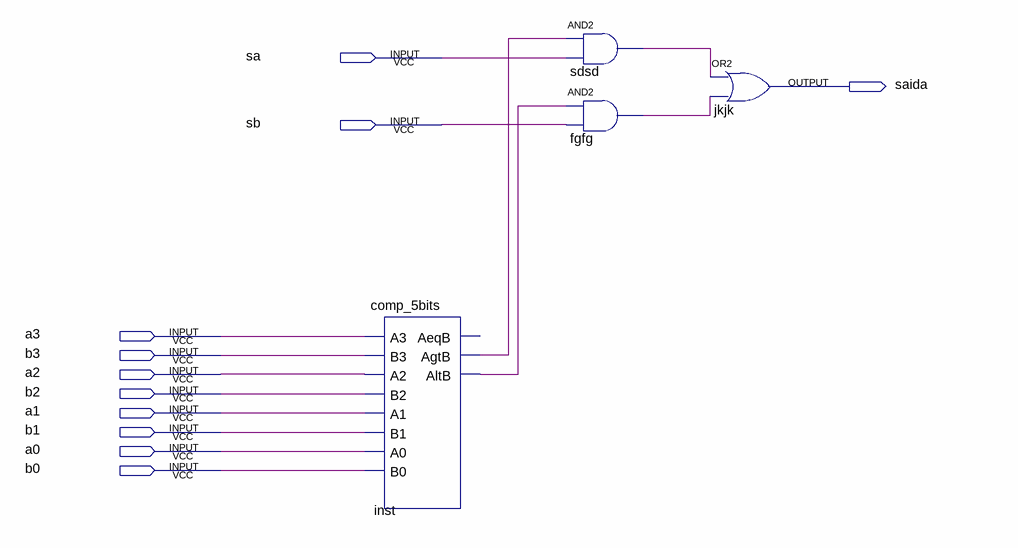
[diagram p0: schematic sheet]
// Quartus schematic LogicaSinal.bdf as structural Verilog: 4 symbols, 11 pins
module LogicaSinal (
  input  sa,
  input  sb,
  input  a3,
  input  b3,
  input  a2,
  input  b2,
  input  a1,
  input  b1,
  input  a0,
  input  b0,
  output saida
);

  wire fgfg_out, inst_agtb, inst_altb, sdsd_out;

  comp_5bits inst (
    .A3(a3), .B3(b3), .A2(a2), .B2(b2), .A1(a1), .B1(b1), .A0(a0), .B0(b0), .AgtB(inst_agtb), .AltB(inst_altb));  // open: AeqB
  and sdsd (sdsd_out, inst_agtb, sa);
  and fgfg (fgfg_out, inst_altb, sb);
  or jkjk (saida, sdsd_out, fgfg_out);
endmodule
